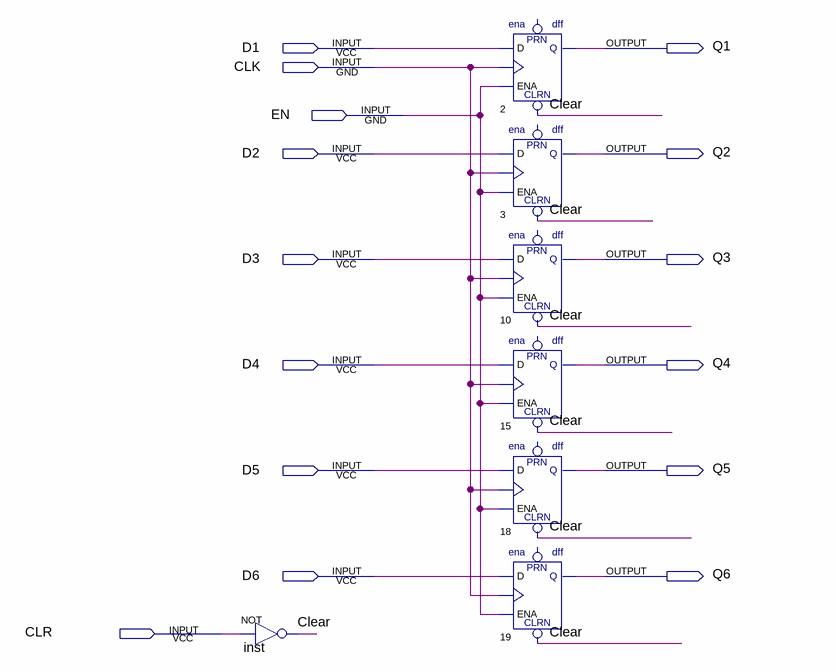
[diagram p0: schematic sheet]
// Quartus schematic 6_Bit_Reg.bdf as structural Verilog: 7 symbols, 15 pins
module \6_Bit_Reg  (
  input  D1,
  input  CLK,
  input  EN,
  input  D2,
  input  D3,
  input  D4,
  input  D5,
  input  D6,
  input  CLR,
  output Q1,
  output Q2,
  output Q3,
  output Q4,
  output Q5,
  output Q6
);

  wire Clear;

  not inst (Clear, CLR);
  enadff u_2 (.ENA(EN), .D(D1), .CLRN(Clear), .CLK(CLK), .Q(Q1));  // open: PRN
  enadff u_3 (.ENA(EN), .D(D2), .CLRN(Clear), .CLK(CLK), .Q(Q2));  // open: PRN
  enadff u_10 (.ENA(EN), .D(D3), .CLRN(Clear), .CLK(CLK), .Q(Q3));  // open: PRN
  enadff u_15 (.ENA(EN), .D(D4), .CLRN(Clear), .CLK(CLK), .Q(Q4));  // open: PRN
  enadff u_18 (.ENA(EN), .D(D5), .CLRN(Clear), .CLK(CLK), .Q(Q5));  // open: PRN
  enadff u_19 (.ENA(EN), .D(D6), .CLRN(Clear), .CLK(CLK), .Q(Q6));  // open: PRN
endmodule
